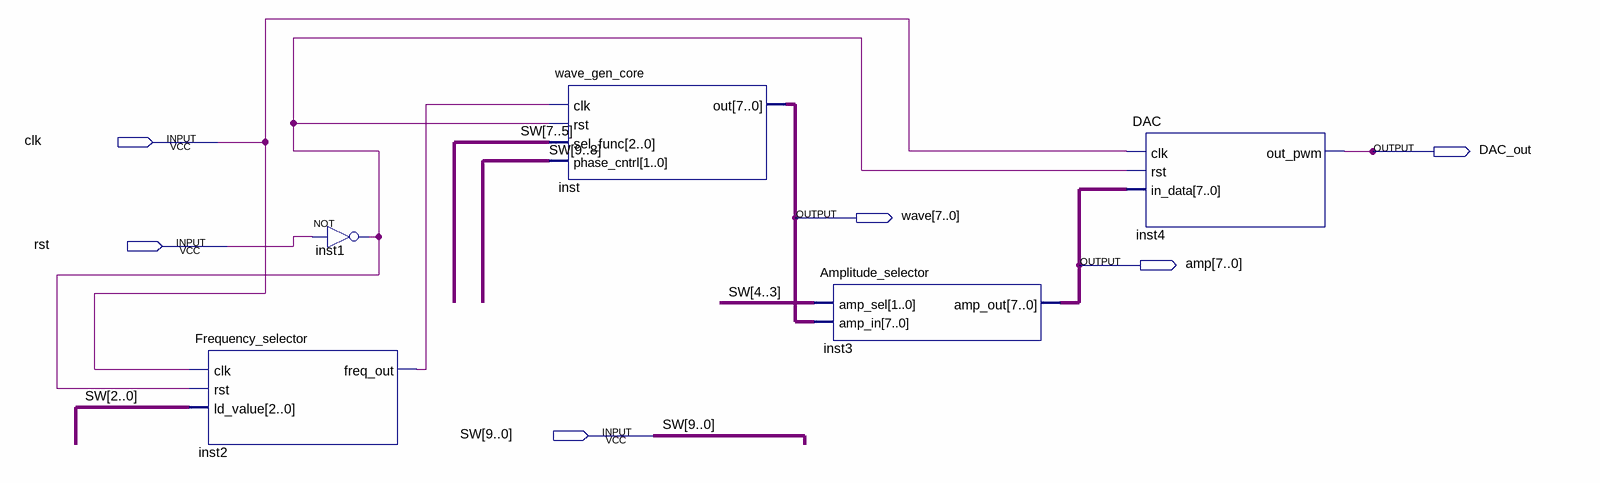
[diagram p0: schematic sheet]
// Quartus schematic quartus_sim.bdf as structural Verilog: 5 symbols, 6 pins
module quartus_sim (
  input  clk,
  input  rst,
  input  [9:0] SW,
  output DAC_out,
  output [7:0] wave,
  output [7:0] amp
);

  wire inst1_out, inst2_freq_out;

  Frequency_selector inst2 (.clk(clk), .rst(inst1_out), .ld_value(SW[2:0]), .freq_out(inst2_freq_out));
  not inst1 (inst1_out, rst);
  wave_gen_core inst (.clk(inst2_freq_out), .rst(inst1_out), .sel_func(SW[7:5]), .phase_cntrl(SW[9:8]), .out(wave));
  Amplitude_selector inst3 (.amp_sel(SW[4:3]), .amp_in(wave), .amp_out(amp));
  DAC inst4 (.clk(clk), .rst(inst1_out), .in_data(amp), .out_pwm(DAC_out));
endmodule
